# Altium schematic sheet Kasli-SOC_QUAD_BUCK.SchDoc: Quad
size 420 x 297 mm; CheckedBy: G.Kasprowicz; Author: F.Switakowski; CompanyName: WUT ISE; DrawnBy: F.Switakowski; Organization: WUT ISE; Address1: PW ISE; Address2: Nowowiejska 15/19 00-665 Warsaw; Address3: gkasprow@gmail.com; DocumentNumber: 16; Revision: 1; SheetNumber: 16; SheetTotal: 18; ModifiedBy: -; CheckedDate: -; Title2: Buck; DivGrp: WUT ISE; Designer: G.Kasprowicz; ModifiedDate: -; ProjectName: Sensor Box
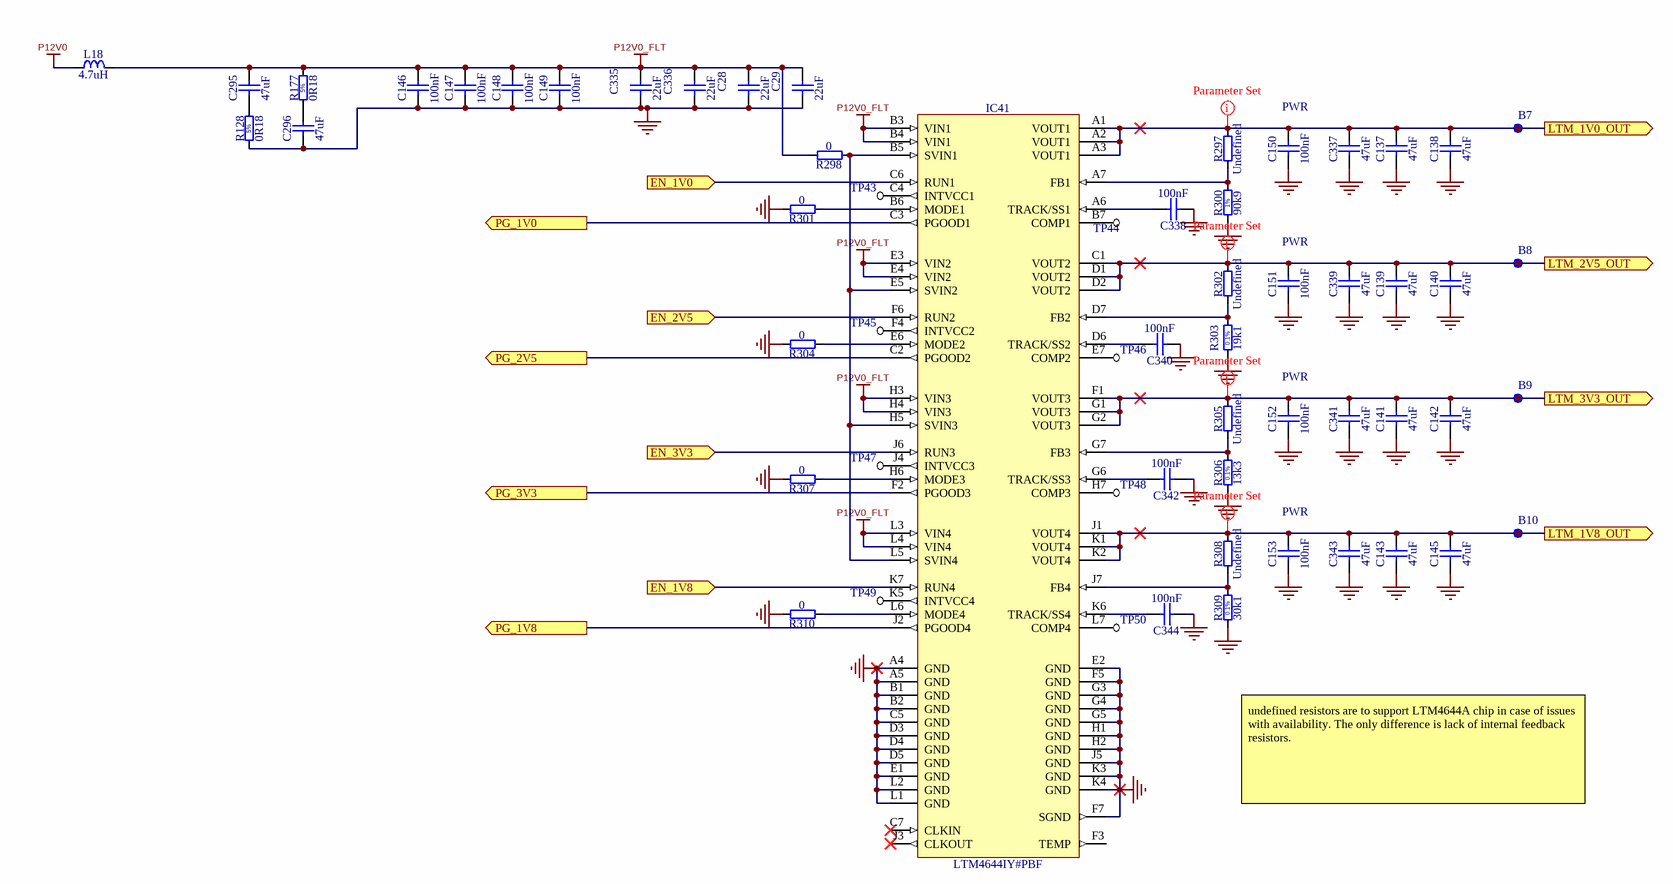
[diagram p0: Kasli-SOC_QUAD_BUCK.SchDoc]

## Parts
B7  SMD Pad  [C75]  (value not drawn)  (no BOM)
B8  SMD Pad  [C75]  (value not drawn)  (no BOM)
B9  SMD Pad  [C75]  (value not drawn)  (no BOM)
B10  SMD Pad  [C75]  (value not drawn)  (no BOM)
C28  22uF  [CAPC2012X135N]
C29  22uF  [CAPC2012X135N]
C137  47uF  [CAPC2012X140N]
C138  47uF  [CAPC2012X140N]
C139  47uF  [CAPC2012X140N]
C140  47uF  [CAPC2012X140N]
C141  47uF  [CAPC2012X140N]
C142  47uF  [CAPC2012X140N]
C143  47uF  [CAPC2012X140N]
C145  47uF  [CAPC2012X140N]
C146  100nF  [CAPC1005X55N]
C147  100nF  [CAPC1005X55N]
C148  100nF  [CAPC1005X55N]
C149  100nF  [CAPC1005X55N]
C150  100nF  [CAPC1005X55N]
C151  100nF  [CAPC1005X55N]
C152  100nF  [CAPC1005X55N]
C153  100nF  [CAPC1005X55N]
C295  47uF  [CAPC5750X200N]
C296  47uF  [CAPC5750X200N]
C335  22uF  [CAPC2012X135N]
C336  22uF  [CAPC2012X135N]
C337  47uF  [CAPC2012X140N]
C338  100nF  [CAPC1005X55N]
C339  47uF  [CAPC2012X140N]
C340  100nF  [CAPC1005X55N]
C341  47uF  [CAPC2012X140N]
C342  100nF  [CAPC1005X55N]
C343  47uF  [CAPC2012X140N]
C344  100nF  [CAPC1005X55N]
IC41  LTM4644IY#PBF  [BGA77C127P7X11_900X1500X521]
L18  4.7uH  [IND_COOPER_DR74]
R128  0R18  [RESC2012X70N]
R177  0R18  [RESC2012X70N]
R297  Undefined  [RESC1608X55N]
R298  0  [RESC1005X40N]
R300  90k9  [RESC1608X55N]
R301  0  [RESC1005X40N]
R302  Undefined  [RESC1608X55N]
R303  19k1  [RESC1608X55N]
R304  0  [RESC1005X40N]
R305  Undefined  [RESC1608X55N]
R306  13k3  [RESC1608X55N]
R307  0  [RESC1005X40N]
R308  Undefined  [RESC1608X55N]
R309  30k1  [RESC1608X55N]
R310  0  [RESC1005X40N]
TP43  TP  [TP]  (value not drawn)  (no BOM)
TP44  TP  [TP]  (value not drawn)  (no BOM)
TP45  TP  [TP]  (value not drawn)  (no BOM)
TP46  TP  [TP]  (value not drawn)  (no BOM)
TP47  TP  [TP]  (value not drawn)  (no BOM)
TP48  TP  [TP]  (value not drawn)  (no BOM)
TP49  TP  [TP]  (value not drawn)  (no BOM)
TP50  TP  [TP]  (value not drawn)  (no BOM)

## Ports
EN_1V0 (in), EN_1V8 (in), EN_2V5 (in), EN_3V3 (in), LTM_1V0_OUT (out), LTM_1V8_OUT (out), LTM_2V5_OUT (out), LTM_3V3_OUT (out), PG_1V0 (out), PG_1V8 (out), PG_2V5 (out), PG_3V3 (out)

## Nets
GND: C28.1 C29.1 C137.1 C138.1 C139.1 C140.1 C141.1 C142.1 C143.1 C145.1 C146.1 C147.1 C148.1 C149.1 C150.1 C151.1 C152.1 C153.1 C296.1 C335.1 C336.1 C337.1 C338.1 C339.1 C340.1 C341.1 C342.1 C343.1 C344.1 IC41.A4(GND) IC41.A5(GND) IC41.B1(GND) IC41.B2(GND) IC41.C5(GND) IC41.D3(GND) IC41.D4(GND) IC41.D5(GND) IC41.E1(GND) IC41.E2(GND) IC41.F5(GND) IC41.F7(SGND) IC41.G3(GND) IC41.G4(GND) IC41.G5(GND) IC41.H1(GND) IC41.H2(GND) IC41.J5(GND) IC41.K3(GND) IC41.K4(GND) IC41.L1(GND) IC41.L2(GND) R128.1 R300.1 R301.2 R303.1 R304.2 R306.1 R307.2 R309.1 R310.2
P12V0: L18.1
P12V0_FLT: C28.2 C29.2 C146.2 C147.2 C148.2 C149.2 C295.2 C335.2 C336.2 IC41.B3(VIN1) IC41.B4(VIN1) IC41.E3(VIN2) IC41.E4(VIN2) IC41.H3(VIN3) IC41.H4(VIN3) IC41.L3(VIN4) IC41.L4(VIN4) L18.2 R177.2 R298.2
EN_1V0: IC41.C6(RUN1) ; port EN_1V0
EN_1V8: IC41.K7(RUN4) ; port EN_1V8
EN_2V5: IC41.F6(RUN2) ; port EN_2V5
EN_3V3: IC41.J6(RUN3) ; port EN_3V3
LTM_1V0_OUT: B7.1 C137.2 C138.2 C150.2 C337.2 IC41.A1(VOUT1) IC41.A2(VOUT1) IC41.A3(VOUT1) R297.2 ; port LTM_1V0_OUT
LTM_1V8_OUT: B10.1 C143.2 C145.2 C153.2 C343.2 IC41.J1(VOUT4) IC41.K1(VOUT4) IC41.K2(VOUT4) R308.2 ; port LTM_1V8_OUT
LTM_2V5_OUT: B8.1 C139.2 C140.2 C151.2 C339.2 IC41.C1(VOUT2) IC41.D1(VOUT2) IC41.D2(VOUT2) R302.2 ; port LTM_2V5_OUT
LTM_3V3_OUT: B9.1 C141.2 C142.2 C152.2 C341.2 IC41.F1(VOUT3) IC41.G1(VOUT3) IC41.G2(VOUT3) R305.2 ; port LTM_3V3_OUT
PG_1V0: IC41.C3(PGOOD1) ; port PG_1V0
PG_1V8: IC41.J2(PGOOD4) ; port PG_1V8
PG_2V5: IC41.C2(PGOOD2) ; port PG_2V5
PG_3V3: IC41.F2(PGOOD3) ; port PG_3V3
NetC295_1: C295.1 R128.2
NetC296_2: C296.2 R177.1
NetC338_2: C338.2 IC41.A6(TRACK/SS1)
NetC340_2: C340.2 IC41.D6(TRACK/SS2)
NetC342_2: C342.2 IC41.G6(TRACK/SS3)
NetC344_2: C344.2 IC41.K6(TRACK/SS4)
NetIC41_A7: IC41.A7(FB1) R297.1 R300.2
NetIC41_B5: IC41.B5(SVIN1) IC41.E5(SVIN2) IC41.H5(SVIN3) IC41.L5(SVIN4) R298.1
NetIC41_B6: IC41.B6(MODE1) R301.1
NetIC41_B7: IC41.B7(COMP1) TP44.1
NetIC41_C4: IC41.C4(INTVCC1) TP43.1
NetIC41_D7: IC41.D7(FB2) R302.1 R303.2
NetIC41_E6: IC41.E6(MODE2) R304.1
NetIC41_E7: IC41.E7(COMP2) TP46.1
NetIC41_F4: IC41.F4(INTVCC2) TP45.1
NetIC41_G7: IC41.G7(FB3) R305.1 R306.2
NetIC41_H6: IC41.H6(MODE3) R307.1
NetIC41_H7: IC41.H7(COMP3) TP48.1
NetIC41_J4: IC41.J4(INTVCC3) TP47.1
NetIC41_J7: IC41.J7(FB4) R308.1 R309.2
NetIC41_K5: IC41.K5(INTVCC4) TP49.1
NetIC41_L6: IC41.L6(MODE4) R310.1
NetIC41_L7: IC41.L7(COMP4) TP50.1

Not connected (* = marked no-connect by the designer): IC41 C7(CLKIN)* F3(TEMP) J3(CLKOUT)*

## Layout directives
net class PWR: LTM_1V0_OUT, LTM_1V8_OUT, LTM_2V5_OUT, LTM_3V3_OUT

## Notes on the sheet
- undefined resistors are to support LTM4644A chip in case of issues with availability. The only difference is lack of internal feedback resistors.
- Project/Equipment
- Document
- Designer
- Drawn by
- Check.by
- Copyright WUT ISE 2020.
  This documentation describes Open Hardware and is licensed under the CERN OHL v.1.2. You may redistribute and modify this documentation under the terms of the CERN OHL v.1.2. (http://ohwr.org/CERNOHL). This documentation is distributed WITHOUT ANY EXPRESS OR IMPLIED WARRANTY, INCLUDING OF MERCHANTABILITY, SATISFACTORY QUALITY AND FITNESS FOR A PARTICULAR PURPOSE. Please see the CERN OHL v.1.2 for applicable conditions.
- Contact
- File
- Last Mod.
- Print Date
- Sheet
- Size
- A3
- of
- Rev
- (in symbol R0603_13K3_0.1%_0.063W_10PPM) 0.1%
- (in symbol R0603_19K1_0.1%_0.063W_10PPM) 0.1%
- (in symbol R0603_30K1_0.1%_0.063W_10PPM) 0.1%
- (in symbol R0603_90K9_1%_0.1W_100PPM) 1%
- (in symbol R0805_0R18_5%_0.25W_250PPM_PANASONIC_ERJ) 5%

## Library data of the parts
B7-B10 = SMD_PAD_D0.75MM: Through Hole Pad; Part Description: 0.75mm Diameter SMD Pad; Mounted: No; Part Number: SMD_PAD_D0.75MM; Component Type: Standard (No BOM); Pin Count: 1; Family: SMD Pad; Socket: No; SMD: No; Sense: No; Status: None; ComponentHeight: 0mm; HelpURL: Undefined; Author: CERN DEM BC; CreateDate: 04.06.2020; LatestRevisionDate: 04.06.2020; PackageDescription: 0.75mm Diameter SMD Pad
C28 C29 C335 C336 = CC0805_22UF_16V_10%_X5R: Non-polarised capacitor; Manufacturer: GENERIC; Part Description: SMD Multilayer Chip Ceramic Capacitor; Manufacturer1 Part Number: C2012X5R1C226KT; Tolerance: ±10%; Voltage: 16V; TC: X5R; Manufacturer Part Number: CC0805_22UF_16V_10%_X5R; Part Number: CC0805_22UF_16V_10%_X5R; Value: 22uF; Component Kind: Standard; Component Type: Standard; Pin Count: 2; Status: Preferred; Case: 0805; Mounted: Yes; Socket: No; SMD: Yes; Sense: No; Manufacturer1 Example: TDK; Manufacturer1 ComponentHeight: 1.35mm; HelpURL: \\cern.ch\dfs\Applications\Altium\Datasheets\CC0805_X5R_TDK_C.pdf; Author: CERN DEM JLC; CreateDate: 25.10.2012; LatestRevisionDate: 25.10.2012
C137-C143 C145 C337 C339 C341 C343 = CC0805_47UF_6.3V_20%_X5R: Non-polarised capacitor; Manufacturer: GENERIC; Part Description: SMD Multilayer Chip Ceramic Capacitor; Manufacturer1 Part Number: C0805C476M9PACTU; Tolerance: ±20%; Voltage: 6.3V; TC: X5R; Manufacturer Part Number: CC0805_47UF_6.3V_20%_X5R; Part Number: CC0805_47UF_6.3V_20%_X5R; Value: 47uF; Component Kind: Standard; Component Type: Standard; Pin Count: 2; Status: Preferred; Case: 0805; Mounted: Yes; Socket: No; SMD: Yes; Sense: No; Manufacturer1 Example: KEMET; Manufacturer1 ComponentHeight: 1.4mm; HelpURL: \\cern.ch\dfs\Applications\Altium\Datasheets\CC0805_X5R_KEMET.pdf; Author: CERN DEM JLC; CreateDate: 16.10.2012; LatestRevisionDate: 16.10.2012
C146-C153 C338 C340 C342 C344 = CC0402_100NF_16V_10%_X7R: Non-polarised capacitor; Part Description: SMD Multilayer Chip Ceramic Capacitor; Manufacturer: GENERIC; Manufacturer1 Part Number: GRM155R71C104KA88D; Voltage: 16V; TC: X7R; Tolerance: ±10%; Part Number: CC0402_100NF_16V_10%_X7R; Component Kind: Standard; Component Type: Standard; Pin Count: 2; Value: 100nF; Status: Not Recommended; Manufacturer Part Number: CC0402_100NF_16V_10%_X7R; Case: 0402; Mounted: Yes; Socket: No; SMD: Yes; Sense: No; Manufacturer1 Example: MURATA; Manufacturer1 ComponentHeight: 0.55mm; HelpURL: \\cern.ch\dfs\Applications\Altium\Datasheets\CC0402_X7R_MURATA_GRM.pdf; Author: CERN DEM JLC; CreateDate: 05/12/2013; LatestRevisionDate: 03/12/2007
C295 C296 = CC2220_47UF_16V_20%_X7R: Non-polarised capacitor; Part Description: Multilayer Ceramic Chip Capacitor; Manufacturer: GENERIC; Manufacturer1 Part Number: C5750X7R1C476M230KB; Voltage: 16V; TC: X7R; Tolerance: ±20%; Part Number: CC2220_47UF_16V_20%_X7R; Component Kind: Standard; Component Type: Standard; Pin Count: 2; Value: 47uF; Status: None; Manufacturer Part Number: CC2220_47UF_16V_20%_X7R; Case: 2220; Mounted: Yes; Socket: No; SMD: Yes; Sense: No; Manufacturer1 Example: TDK; Manufacturer1 ComponentHeight: 2.5mm; HelpURL: \\cern.ch\dfs\Applications\Altium\Datasheets\CC2220_X7R_TDK_C.pdf; Author: CERN DEM JLC; CreateDate: 1/31/2017; LatestRevisionDate: 1/31/2017
IC41 = LTM4644IY#PBF: Quad DC/DC µModule Regulator with Configurable 4A Output Array; Part Description: 4V-14V to 0.6V-5.5V Quad DC/DC uModule (Power Module) Regulator with Configurable 4A Output Array; Manufacturer: LINEAR TECHNOLOGY; PressFit: No; Bonding: No; Part Number: LTM4644IY#PBF; Component Kind: Standard; Component Type: Standard; Device: LTM4644IY#PBF; PackageDescription: BGA, 1.27mm Pitch, Rect.; 77 Pin, 7 Columns X 11 Rows, 9.00mm X 15.00mm X 5.21mm H; Manufacturer Part Number: LTM4644IY#PBF; Pin Count: 77; Case: BGA77; Mounted: Yes; Socket: No; SMD: Yes; Sense: No; ComponentHeight: 5.21mm; HelpURL: \\cern.ch\dfs\Applications\Altium\Datasheets\LTM4644IY#PBF.pdf; Author: CERN DEM JLC; CreateDate: 25.04.2018; LatestRevisionDate: 25.04.2018
L18 = IND_4.7UH_20%_COOPER_DR74-4R7-R: Inductor; Part Description: High Power Density, High Efficiency, Shielded Drum Core Power Inductor; Manufacturer: COOPER INDUSTRIES / EATON; Power: 3.34A; Resistance: 0.0254R; Tolerance: ±20%; Part Number: IND_4.7UH_20%_COOPER_DR74-4R7-R; Component Kind: Standard; Component Type: Standard; Pin Count: 2; Value: 4.7uH; Status: None; Manufacturer Part Number: DR74-4R7-R; Mounted: Yes; Socket: No; SMD: Yes; Sense: No; ComponentHeight: 4.35mm; HelpURL: \\cern.ch\dfs\Applications\Altium\Datasheets\IND_COOPER_DR74.pdf; Author: CERN DEM JLC; CreateDate: 2017-11-23; LatestRevisionDate: 2017-11-23
R128 R177 = R0805_0R18_5%_0.25W_250PPM_PANASONIC_ERJ: Resistor - 5%; Part Description: Low Resistance Thick Film Chip Resistor; Manufacturer Part Number: ERJ6BSJR18V; Power: 0.25W; TC: ±250ppm/°C; PressFit: No; Part Number: R0805_0R18_5%_0.25W_250PPM_PANASONIC_ERJ; Component Kind: Standard; Component Type: Standard; Pin Count: 2; Value: 0R18; Status: Not Recommended; Tolerance: ±5%; Manufacturer: PANASONIC; Case: 0805; Mounted: Yes; Sense: No; Socket: No; SMD: Yes; ComponentHeight: 0.7mm; HelpURL: \\cern.ch\dfs\Applications\Altium\Datasheets\R0805_PANASONIC_ERJ.pdf; Author: CERN DEM JLC; CreateDate: 6/22/2011; LatestRevisionDate: 6/22/2011
R297 R302 R305 R308 = R0603_NO-VALUE: Resistor; Part Description: Reserved Footprint For a 0603 (1608) Chip Resistor; PressFit: No; Mounted: No; Part Number: R0603_NO-VALUE; Component Kind: Standard; Component Type: Standard; Pin Count: 2; Value: Undefined; Status: None; Manufacturer: Undefined; Manufacturer Part Number: R0603_NO-VALUE; Case: 0603; Sense: No; Socket: No; SMD: Yes; Manufacturer1 Example: Undefined; Manufacturer1 Part Number: Undefined; Manufacturer1 ComponentHeight: Undefined; HelpURL: Undefined; Author: CERN DEM JLC; CreateDate: 03.12.2007; LatestRevisionDate: 13.03.2008
R298 R301 R304 R307 R310 = R0402_0R_JUMPER: Resistor; Manufacturer: GENERIC; Part Description: 1A (0.05R Max DC Resistance) Zero Ohm Jumper; Manufacturer1 Part Number: 232270591001L; PressFit: No; Manufacturer Part Number: R0402_0R_JUMPER; Part Number: R0402_0R_JUMPER; Value: 0; Component Kind: Standard; Component Type: Standard; Pin Count: 2; Status: Not Recommended; Case: 0402; Mounted: Yes; Sense: No; Socket: No; SMD: Yes; Manufacturer1 Example: YAGEO PHYCOMP; Manufacturer1 ComponentHeight: 0.4mm; HelpURL: \\cern.ch\dfs\Applications\Altium\Datasheets\R0402_Phycomp_RC0402.pdf; Author: CERN DEM JLC; CreateDate: 03.12.2007; LatestRevisionDate: 17.10.2012
R300 = R0603_90K9_1%_0.1W_100PPM: Resistor - 1%; Part Description: General Purpose Thick Film Chip Resistor; Manufacturer: GENERIC; Manufacturer1 Part Number: CRCW060390K9FKEA; Power: 0.1W; TC: ±100ppm/°C; PressFit: No; Part Number: R0603_90K9_1%_0.1W_100PPM; Component Kind: Standard; Component Type: Standard; Pin Count: 2; Value: 90k9; Status: Preferred; Tolerance: ±1%; Manufacturer Part Number: R0603_90K9_1%_0.1W_100PPM; Case: 0603; Mounted: Yes; Sense: No; Socket: No; SMD: Yes; Manufacturer1 Example: VISHAY; Manufacturer1 ComponentHeight: 0.55mm; HelpURL: \\cern.ch\dfs\Applications\Altium\Datasheets\R0603_VISHAY_CRCW e3.pdf; Author: CERN DEM JLC; CreateDate: 14.03.2018; LatestRevisionDate: 14.03.2018
R303 = R0603_19K1_0.1%_0.063W_10PPM: Resistor - 0.1%; Part Description: Thin Film Chip Resistor; Manufacturer: GENERIC; Manufacturer1 Part Number: RN73C1J19K1BTDF; Power: 0.063W; TC: ±10ppm; PressFit: No; Part Number: R0603_19K1_0.1%_0.063W_10PPM; Component Kind: Standard; Component Type: Standard; Pin Count: 2; Value: 19k1; Status: Not Recommended; Tolerance: ±0.1%; Manufacturer Part Number: R0603_19K1_0.1%_0.063W_10PPM; Case: 0603; Mounted: Yes; Sense: No; Socket: No; SMD: Yes; Manufacturer1 Example: TYCO HOLSWORTHY; Manufacturer1 ComponentHeight: 0.5mm; HelpURL: \\cern.ch\dfs\Applications\Altium\Datasheets\R0603_Tyco_RN73.pdf; Author: CERN DEM JLC; CreateDate: 03.12.2007; LatestRevisionDate: 13.03.2008
R306 = R0603_13K3_0.1%_0.063W_10PPM: Resistor - 0.1%; Part Description: Thin Film Chip Resistor; Manufacturer: GENERIC; Manufacturer1 Part Number: RN73C1J13K3BTDF; Power: 0.063W; TC: ±10ppm; PressFit: No; Part Number: R0603_13K3_0.1%_0.063W_10PPM; Component Kind: Standard; Component Type: Standard; Pin Count: 2; Value: 13k3; Status: Not Recommended; Tolerance: ±0.1%; Manufacturer Part Number: R0603_13K3_0.1%_0.063W_10PPM; Case: 0603; Mounted: Yes; Sense: No; Socket: No; SMD: Yes; Manufacturer1 Example: TYCO HOLSWORTHY; Manufacturer1 ComponentHeight: 0.5mm; HelpURL: \\cern.ch\dfs\Applications\Altium\Datasheets\R0603_Tyco_RN73.pdf; Author: CERN DEM JLC; CreateDate: 03.12.2007; LatestRevisionDate: 13.03.2008
R309 = R0603_30K1_0.1%_0.063W_10PPM: Resistor - 0.1%; Part Description: Thin Film Chip Resistor; Manufacturer: GENERIC; Manufacturer1 Part Number: RN73C1J30K1BTDF; Power: 0.063W; TC: ±10ppm; PressFit: No; Part Number: R0603_30K1_0.1%_0.063W_10PPM; Component Kind: Standard; Component Type: Standard; Pin Count: 2; Value: 30k1; Status: Not Recommended; Tolerance: ±0.1%; Manufacturer Part Number: R0603_30K1_0.1%_0.063W_10PPM; Case: 0603; Mounted: Yes; Sense: No; Socket: No; SMD: Yes; Manufacturer1 Example: TYCO HOLSWORTHY; Manufacturer1 ComponentHeight: 0.5mm; HelpURL: \\cern.ch\dfs\Applications\Altium\Datasheets\R0603_Tyco_RN73.pdf; Author: CERN DEM JLC; CreateDate: 03.12.2007; LatestRevisionDate: 13.03.2008
TP43-TP50 = TP: Testpoint